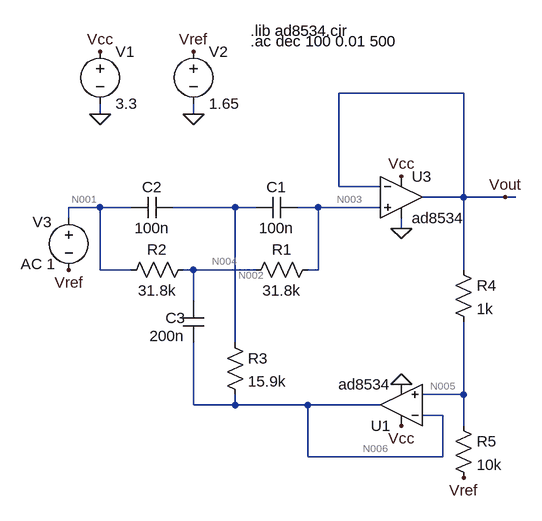
[diagram p0: schematic Notch.asc]
Notch.asc, the LTspice schematic file:
Version 4.1
SHEET 1 1132 752
WIRE 544 64 352 64
WIRE -16 96 -16 80
WIRE 128 96 128 80
WIRE 352 208 352 64
WIRE 416 208 352 208
WIRE 544 224 544 64
WIRE 544 224 480 224
WIRE 608 224 544 224
WIRE 624 224 608 224
WIRE -16 240 -64 240
WIRE 32 240 -16 240
WIRE 192 240 96 240
WIRE 224 240 192 240
WIRE 320 240 288 240
WIRE 416 240 320 240
WIRE -64 256 -64 240
WIRE 448 272 448 256
WIRE -16 336 -16 240
WIRE 32 336 -16 336
WIRE 128 336 112 336
WIRE 224 336 128 336
WIRE 320 336 320 240
WIRE 320 336 304 336
WIRE 544 336 544 224
WIRE 128 384 128 336
WIRE 192 448 192 240
WIRE 544 528 544 416
WIRE 544 528 480 528
WIRE 128 544 128 448
WIRE 192 544 192 528
WIRE 192 544 128 544
WIRE 304 544 192 544
WIRE 416 544 304 544
WIRE 512 560 480 560
WIRE 544 576 544 528
WIRE 304 624 304 544
WIRE 512 624 512 560
WIRE 512 624 304 624
FLAG -16 96 0
FLAG -16 0 Vcc
FLAG 128 96 0
FLAG 128 0 Vref
FLAG 448 272 0
FLAG 448 192 Vcc
FLAG 608 224 Vout
FLAG 544 656 Vref
FLAG -64 336 Vref
FLAG 448 576 Vcc
FLAG 448 512 0
SYMBOL voltage -16 -16 R0
SYMATTR InstName V1
SYMATTR Value 3.3
SYMBOL voltage 128 -16 R0
SYMATTR InstName V2
SYMATTR Value 1.65
SYMBOL OpAmps\\opamp2 448 160 R0
SYMATTR InstName U3
SYMATTR Value ad8534
SYMBOL voltage -64 240 R0
WINDOW 0 -56 22 Left 2
WINDOW 123 -74 87 Left 2
WINDOW 39 0 0 Left 0
SYMATTR InstName V3
SYMATTR Value ""
SYMATTR Value2 AC 1
SYMBOL res 528 320 R0
SYMATTR InstName R4
SYMATTR Value 1k
SYMBOL res 528 560 R0
SYMATTR InstName R5
SYMATTR Value 10k
SYMBOL cap 288 224 R90
WINDOW 0 0 32 VBottom 2
WINDOW 3 32 32 VTop 2
SYMATTR InstName C1
SYMATTR Value 100n
SYMBOL cap 96 224 R90
WINDOW 0 0 32 VBottom 2
WINDOW 3 32 32 VTop 2
SYMATTR InstName C2
SYMATTR Value 100n
SYMBOL res 320 320 R90
WINDOW 0 0 56 VBottom 2
WINDOW 3 32 56 VTop 2
SYMATTR InstName R1
SYMATTR Value 31.8k
SYMBOL res 128 320 R90
WINDOW 0 0 56 VBottom 2
WINDOW 3 32 56 VTop 2
SYMATTR InstName R2
SYMATTR Value 31.8k
SYMBOL cap 112 384 R0
WINDOW 0 -27 26 Left 2
WINDOW 3 -52 54 Left 2
SYMATTR InstName C3
SYMATTR Value 200n
SYMBOL res 176 432 R0
SYMATTR InstName R3
SYMATTR Value 15.9k
SYMBOL OpAmps\\opamp2 448 608 R180
SYMATTR InstName U1
SYMATTR Value ad8534
TEXT 216 -16 Left 2 !.ac dec 100 0.01 500
TEXT 216 -32 Left 2 !.lib ad8534.cir

The netlist it stands for:
* Notch.asc
V1 Vcc 0 3.3
V2 Vref 0 1.65
X§U3 N003 Vout Vcc 0 Vout ad8534  ; pins In+ In- V+ V- OUT
V3 N001 Vref AC 1
R4 Vout N005 1k
R5 N005 Vref 10k
C1 N003 N002 100n
C2 N002 N001 100n
R1 N003 N004 31.8k
R2 N004 N001 31.8k
C3 N004 N006 200n
R3 N002 N006 15.9k
X§U1 N005 N006 Vcc 0 N006 ad8534  ; pins In+ In- V+ V- OUT
.ac dec 100 0.01 500
.lib ad8534.cir
.backanno
.end

* Results of the author's LTspice run, read from the files saved beside the schematic
* Operating Point, zero values left out:
*   V(n001) = 1.65 V
*   V(n002) = 1.66 V
*   V(n003) = 1.65 V
*   V(n004) = 1.65 V
*   V(n005) = 1.655 V
*   V(n006) = 1.66 V
*   V(vcc) = 3.3 V
*   V(vout) = 1.655 V
*   V(vref) = 1.65 V
*   I(R1) = -4.5 pA
*   I(R2) = -4.5 pA
*   I(R4) = 455.5 nA
*   I(R5) = 455.5 nA
*   I(V1) = -1.174 mA
*   I(V2) = 455.5 nA
*   I(V3) = -4.5 pA
*   Ix(u1:1) = 4.5 pA
*   Ix(u1:2) = 5.5 pA
*   Ix(u1:40) = -5.501 pA
*   Ix(u1:50) = -586.6 µA
*   Ix(u1:99) = 586.6 µA
*   Ix(u3:1) = 4.5 pA
*   Ix(u3:2) = 5.5 pA
*   Ix(u3:40) = -455.5 nA
*   Ix(u3:50) = -586.4 µA
*   Ix(u3:99) = 586.9 µA
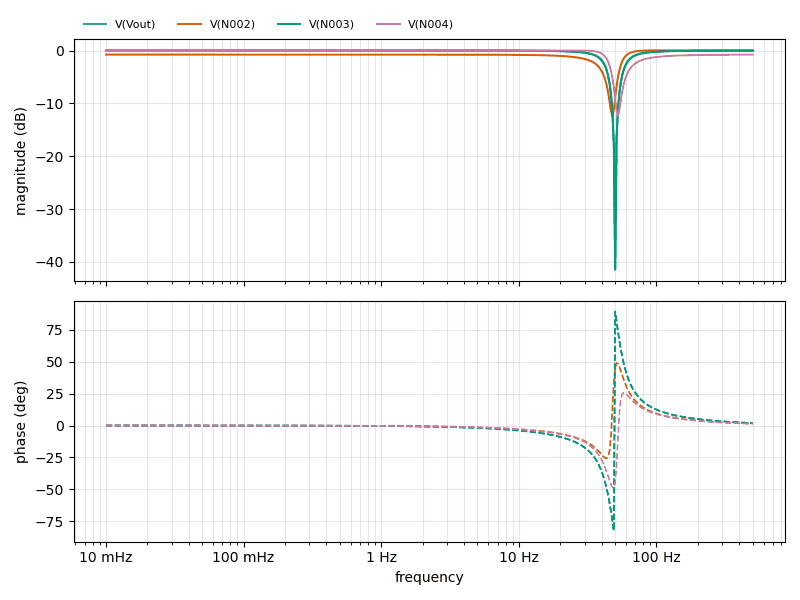
[diagram p1: AC Analysis of Notch.asc, plotted from the saved traces]
* AC Analysis, 1 run:
*   V(Vout): 0.04 dB at 10 mHz, 0.03 dB at 500 Hz, peak 0.04 dB at 10 mHz, 3 dB below the peak at 42.42 Hz
*   V(N002): -0.75 dB at 10 mHz, 0.00 dB at 500 Hz, peak 0.04 dB at 102.3 Hz, 3 dB below the peak at 54.74 Hz
*   V(N003): -0.00 dB at 10 mHz, -0.01 dB at 500 Hz, peak -0.00 dB at 10 mHz, 3 dB below the peak at 42.42 Hz
*   V(N004): 0.00 dB at 10 mHz, -0.76 dB at 500 Hz, peak 0.04 dB at 24.55 Hz, 3 dB below the peak at 45.77 Hz